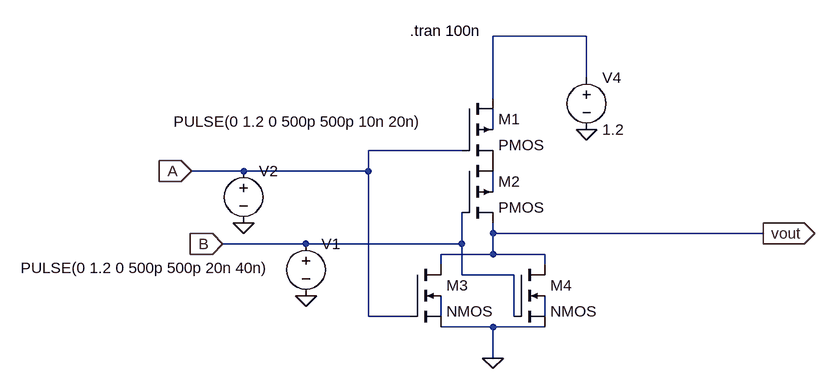
[diagram p0: schematic NOR.asc]
NOR.asc, the LTspice schematic file:
Version 4.1
SHEET 1 880 680
WIRE 304 -64 160 -64
WIRE 304 0 304 -64
WIRE 160 32 160 -64
WIRE 160 80 160 48
WIRE 112 112 -32 112
WIRE -224 144 -304 144
WIRE -32 144 -32 112
WIRE -32 144 -224 144
WIRE 160 176 160 144
WIRE 160 240 160 224
WIRE 576 240 160 240
WIRE -128 256 -256 256
WIRE 112 256 112 208
WIRE 112 256 -128 256
WIRE 160 272 160 240
WIRE 160 272 80 272
WIRE 240 272 160 272
WIRE 80 288 80 272
WIRE 240 288 240 272
WIRE 112 304 112 256
WIRE 192 304 112 304
WIRE -32 368 -32 144
WIRE 32 368 -32 368
WIRE 80 368 80 336
WIRE 192 368 192 304
WIRE 240 368 240 336
WIRE 160 384 80 384
WIRE 240 384 160 384
WIRE 160 432 160 384
FLAG 160 432 0
FLAG -128 336 0
FLAG -224 224 0
FLAG 304 80 0
FLAG 576 240 vout
IOPIN 576 240 Out
FLAG -304 144 A
IOPIN -304 144 In
FLAG -256 256 B
IOPIN -256 256 In
SYMBOL pmos4 112 32 R0
SYMATTR InstName M1
SYMBOL pmos4 112 128 R0
SYMATTR InstName M2
SYMBOL nmos4 32 288 R0
SYMATTR InstName M3
SYMBOL nmos4 192 288 R0
SYMATTR InstName M4
SYMBOL voltage -128 240 R0
WINDOW 3 -439 53 Left 2
WINDOW 123 0 0 Left 0
WINDOW 39 0 0 Left 0
SYMATTR Value PULSE(0 1.2 0 500p 500p 20n 40n)
SYMATTR InstName V1
SYMBOL voltage -224 128 R0
WINDOW 3 -108 -60 Left 2
WINDOW 123 0 0 Left 0
WINDOW 39 0 0 Left 0
SYMATTR Value PULSE(0 1.2 0 500p 500p 10n 20n)
SYMATTR InstName V2
SYMBOL voltage 304 -16 R0
WINDOW 123 0 0 Left 0
WINDOW 39 0 0 Left 0
SYMATTR InstName V4
SYMATTR Value 1.2
TEXT 32 -72 Left 2 !.tran 100n

The netlist it stands for:
* NOR.asc
M1 N001 A P001 N002 PMOS
M2 P001 B vout N003 PMOS
M3 vout A 0 N004 NMOS
M4 vout B 0 N005 NMOS
V1 B 0 PULSE(0 1.2 0 500p 500p 20n 40n)
V2 A 0 PULSE(0 1.2 0 500p 500p 10n 20n)
V4 N001 0 1.2
.model NMOS NMOS
.model PMOS PMOS
.lib standard.mos
.tran 100n
.backanno
.end